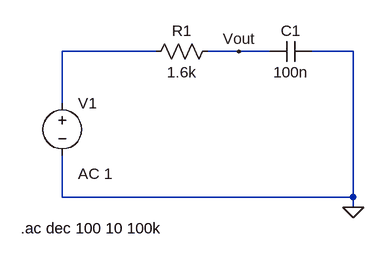
[diagram p0: schematic AFE_Filter_01_RC.asc]
AFE_Filter_01_RC.asc, the LTspice schematic file:
Version 4
SHEET 1 1092 680
WIRE 64 -48 -80 -48
WIRE 192 -48 144 -48
WIRE 240 -48 192 -48
WIRE 368 -48 304 -48
WIRE -80 32 -80 -48
WIRE -80 176 -80 112
WIRE 368 176 368 -48
WIRE 368 176 -80 176
WIRE 368 192 368 176
FLAG 192 -48 Vout
FLAG 368 192 0
SYMBOL voltage -80 16 R0
WINDOW 123 24 124 Left 2
WINDOW 39 0 0 Left 0
SYMATTR InstName V1
SYMATTR Value ""
SYMATTR Value2 AC 1
SYMBOL res 160 -64 R90
WINDOW 0 0 56 VBottom 2
WINDOW 3 32 56 VTop 2
SYMATTR InstName R1
SYMATTR Value 1.6k
SYMBOL cap 304 -64 R90
WINDOW 0 0 32 VBottom 2
WINDOW 3 32 32 VTop 2
SYMATTR InstName C1
SYMATTR Value 100n
TEXT -144 224 Left 2 !.ac dec 100 10 100k

The netlist it stands for:
* AFE_Filter_01_RC.asc
V1 N001 0 AC 1
R1 Vout N001 1.6k
C1 0 Vout 100n
.ac dec 100 10 100k
.backanno
.end

* Results of the author's LTspice run, read from the files saved beside the schematic
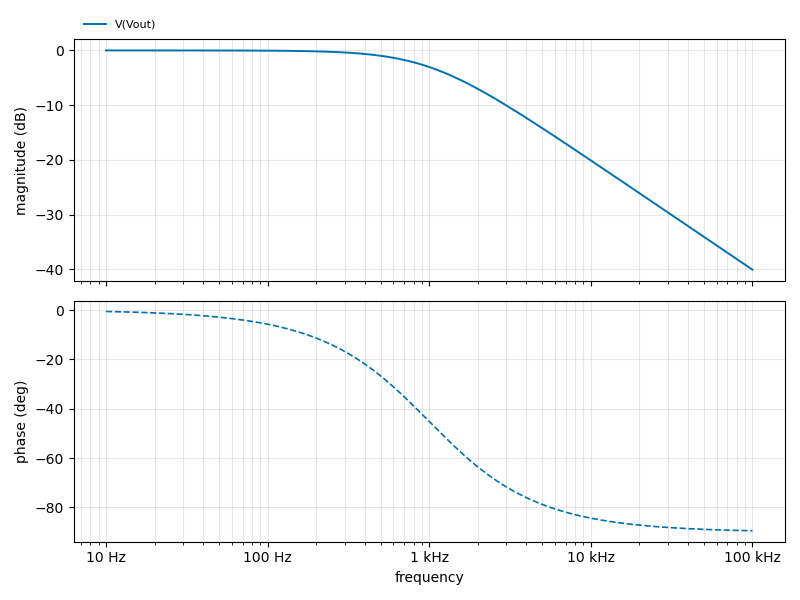
[diagram p1: AC Analysis of AFE_Filter_01_RC.asc, plotted from the saved traces]
* AC Analysis, 1 run:
*   V(Vout): -0.00 dB at 10 Hz, -40.05 dB at 100 kHz, peak -0.00 dB at 10 Hz, 3 dB below the peak at 994.8 Hz